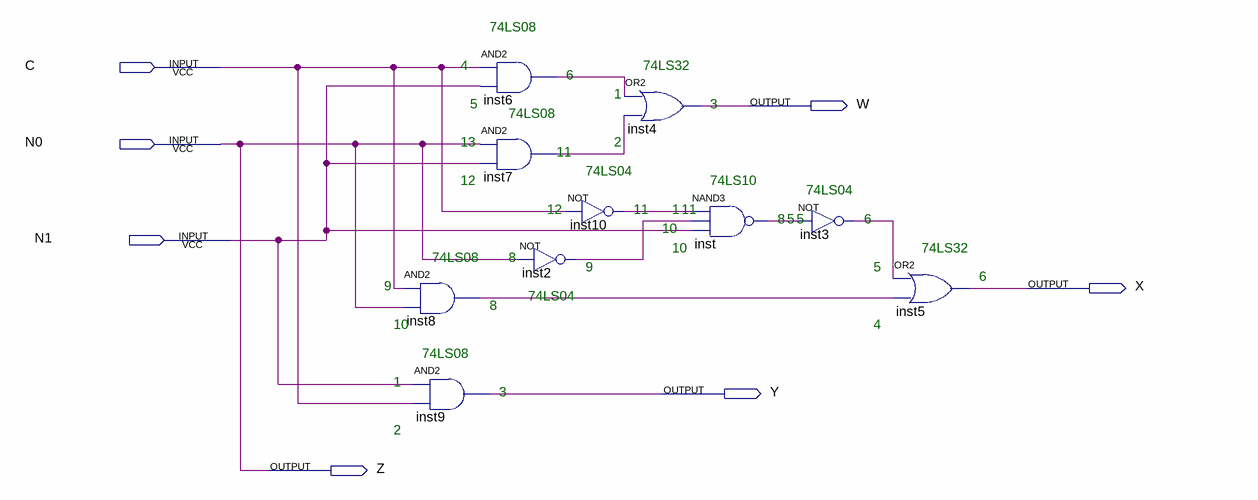
[diagram p0: schematic sheet]
// Quartus schematic Lab04.bdf as structural Verilog: 10 symbols, 7 pins
module Lab04 (
  input  C,
  input  N0,
  input  N1,
  output W,
  output X,
  output Y,
  output Z
);

  wire inst2_out, inst3_out, inst6_out, inst7_out, inst8_out, inst10_out, inst_out;

  and inst8 (inst8_out, C, N0);
  and inst9 (Y, N1, C);
  and inst6 (inst6_out, C, N1);
  and inst7 (inst7_out, N0, N1);
  not inst10 (inst10_out, C);
  not inst2 (inst2_out, N0);
  or inst4 (W, inst6_out, inst7_out);
  nand inst (inst_out, inst10_out, inst2_out, N1);
  not inst3 (inst3_out, inst_out);
  or inst5 (X, inst3_out, inst8_out);

  assign Z = N0;

  // Notes on the sheet:
  //   74LS08
  //   4
  //   74LS32
  //   6
  //   1
  //   5
  //   3
  //   74LS08
  //   13
  //   2
  //   11
  //   74LS04
  //   12
  //   74LS10
  //   74LS04
  //   12
  //   11
  //   1
  //   11
  //   8
  //   5
  //   5
  //   6
  //   10
  //   10
  //   74LS32
  //   74LS08
  //   8
  //   9
  //   5
  //   6
  //   9
  //   74LS04
  //   8
  //   10
  //   4
  //   74LS08
  //   1
  //   3
  //   2
endmodule
